# Altium project Lipo_Solar_Charger.PrjPcb
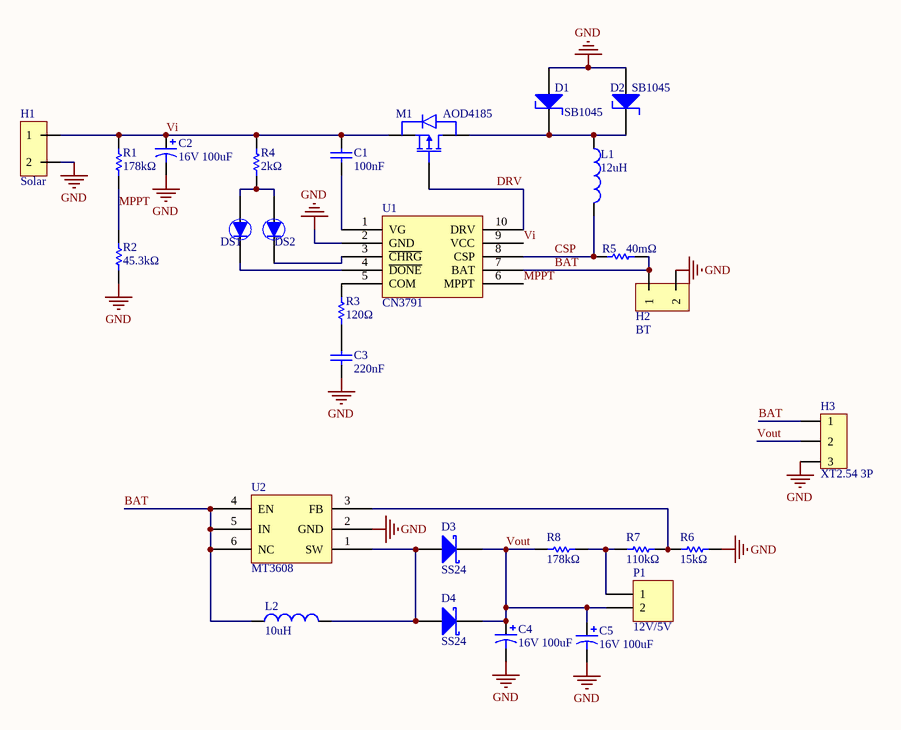
[diagram p0: Lipo_Solar_Charger.SchDoc]
1 sheet, 28 parts. Net scope: global (net labels, ports and power ports of the same name join across sheets).
Board file: Lipo_Solar_Charger.PcbDoc

## Sheet Lipo_Solar_Charger.SchDoc
size A4

### Parts
C1  100nF  [0603]
C2  16V 100uF  [7343 Tantalum Capacitor]
C3  220nF  [0603]
C4  16V 100uF  [7343 Tantalum Capacitor]
C5  16V 100uF  [7343 Tantalum Capacitor]
D1  SB1045  [TO-277]
D2  SB1045  [TO-277]
D3  SS24  [SMD Diode SMB]
D4  SS24  [SMD Diode SMB]
DS1  LED  [0603_LED]  (value not drawn)
DS2  LED  [0603_LED]  (value not drawn)
H1  Solar  [XH2.54 2P]
H2  BT  [XH2.54 2P]
H3  XT2.54 3P  [XH2.54 3P]
L1  12uH  [CDEP147]
L2  10uH  [CD75]
M1  AOD4185  [TO-252AA]
P1  12V/5V  [HDR1X2]
R1  178kΩ  [1608[0603]]
R2  45.3kΩ  [1608[0603]]
R3  120Ω  [1608[0603]]
R4  2kΩ  [1608[0603]]
R5  40mΩ  [2512[6432]]
R6  15kΩ  [1608[0603]]
R7  110kΩ  [1608[0603]]
R8  178kΩ  [1608[0603]]
U1  CN3791  [SOIC100P600X175-10N]
U2  MT3608  [SOT23-6_L]

### Nets
GND: C2.2 C3.1 C4.2 C5.2 D1.1(A) D2.1(A) H1.2 H2.2 H3.3 R2.1 R6.1 U1.2(GND) U2.2(GND)
BAT: H2.1 H3.1 L2.1 R5.1 U1.7(BAT) U2.4(EN) U2.5(IN) U2.6(NC)
CSP: L1.2 R5.2 U1.8(CSP)
DRV: M1.1(G) U1.10(DRV)
MPPT: R1.1 R2.2 U1.6(MPPT)
Vi: C1.2 C2.1 H1.1 M1.3(S) R1.2 R4.2 U1.9(VCC)
Vout: C4.1 C5.1 D3.2(K) D4.2(K) H3.2 P1.2 R8.2
NetC1_1: C1.1 U1.1(VG)
NetC3_2: C3.2 R3.1
NetD1_2: D1.2(K) D2.2(K) L1.1 M1.2(D)
NetD3_1: D3.1(A) D4.1(A) L2.2 U2.1(SW)
NetDS1_1: DS1.1(A) DS2.1(A) R4.1
NetDS1_2: DS1.2(K) U1.4(~{DONE})
NetDS2_2: DS2.2(K) U1.3(~{CHRG})
NetP1_1: P1.1 R7.2 R8.1
NetR3_2: R3.2 U1.5(COM)
NetR6_2: R6.2 R7.1 U2.3(FB)

### Library data of the parts
C1 C3 = cap2
C2 C4 C5 = cap: 有極性電容
D1 D2 = SB1045: 10.0A SCHOTTKY BARRIER RECTIFIER
D3 D4 = DIODE: Schottky Rectifier
H1 H2 = XH2.54 2P
H3 = XH2.54 3P
L1 L2 = inductor_1
M1 = AOD4185: P-Channel Enhancement Mode Field Effect Transistor
P1 = Header 2: Header, 2-Pin; LatestRevisionDate: 17-Jul-2002; LatestRevisionNote: Re-released for DXP Platform.; Publisher: Altium Limited
R1-R4 R6-R8 = Res: Resistor; Published: 8-Jun-2000; LatestRevisionDate: 17-Jul-2002; LatestRevisionNote: Re-released for DXP Platform.; PackageReference: AXIAL-0.3; Publisher: Altium Limited
R5 = Res: R sense
U1 = CN3791: 4A, Standalone Li-ion Battery Charger IC  With Photovoltaic Cell MPPT Function
U2 = MT3608: High Efficiency 1.2MHz  2A Step Up Converter